# Altium schematic sheet mounting_circuit(4).SchDoc
size A4; SheetNumber: 5; SheetTotal: 5
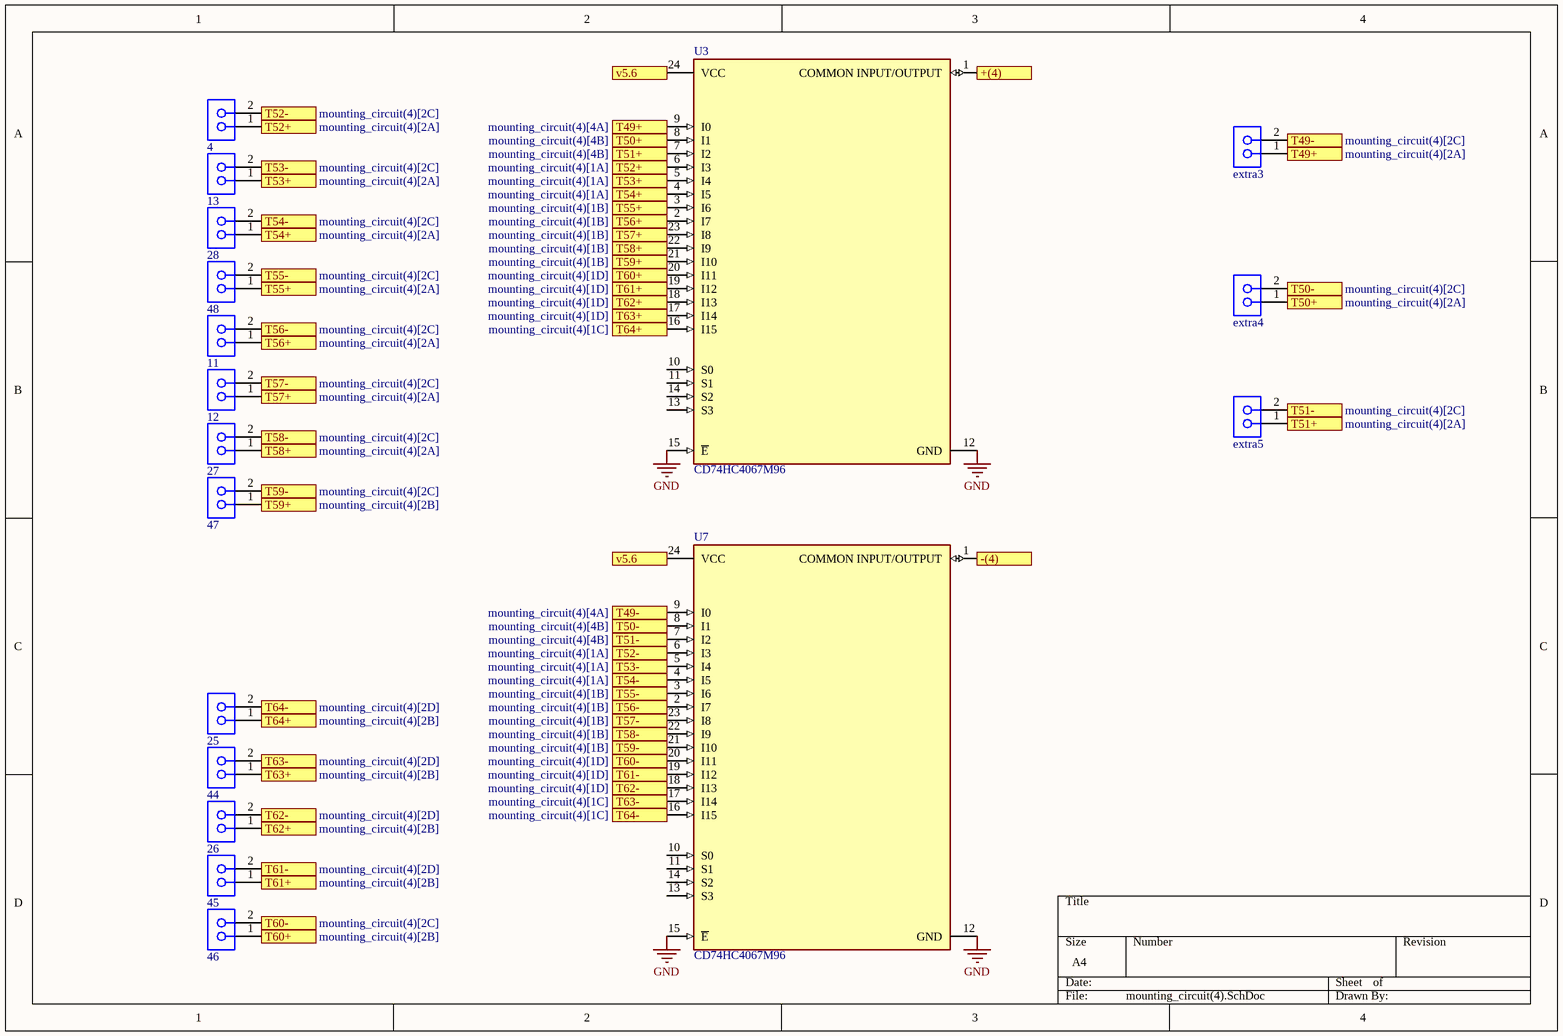
[diagram p0: mounting_circuit(4).SchDoc]

## Parts
4  Comment  [SMTC-SSW-102-02-X-S]  (value not drawn)
11  1  [SMTC-SSW-102-02-X-S]  (value not drawn)
12  Comment  [SMTC-SSW-102-02-X-S]  (value not drawn)
13  Comment  [SMTC-SSW-102-02-X-S]  (value not drawn)
25  0  [SMTC-SSW-102-02-X-S]  (value not drawn)
26  Comment  [SMTC-SSW-102-02-X-S]  (value not drawn)
27  Comment  [SMTC-SSW-102-02-X-S]  (value not drawn)
28  Comment  [SMTC-SSW-102-02-X-S]  (value not drawn)
44  0  [SMTC-SSW-102-02-X-S]  (value not drawn)
45  Comment  [SMTC-SSW-102-02-X-S]  (value not drawn)
46  Comment  [SMTC-SSW-102-02-X-S]  (value not drawn)
47  Comment  [SMTC-SSW-102-02-X-S]  (value not drawn)
48  Comment  [SMTC-SSW-102-02-X-S]  (value not drawn)
extra3  Comment  [SMTC-SSW-102-02-X-S]  (value not drawn)
extra4  Comment  [SMTC-SSW-102-02-X-S]  (value not drawn)
extra5  Comment  [SMTC-SSW-102-02-X-S]  (value not drawn)
U3  CD74HC4067M96  [FP-DW0024A-MFG]
U7  CD74HC4067M96  [FP-DW0024A-MFG]

## Ports
+(4), -(4), T49+ (see mounting_circuit(4)[2A]), T49+ (see mounting_circuit(4)[4A]), T49- (see mounting_circuit(4)[2C]), T49- (see mounting_circuit(4)[4A]), T50+ (see mounting_circuit(4)[2A]), T50+ (see mounting_circuit(4)[4B]), T50- (see mounting_circuit(4)[2C]), T50- (see mounting_circuit(4)[4B]), T51+ (see mounting_circuit(4)[2A]), T51+ (see mounting_circuit(4)[4B]), T51- (see mounting_circuit(4)[2C]), T51- (see mounting_circuit(4)[4B]), T52+ (see mounting_circuit(4)[1A]), T52+ (see mounting_circuit(4)[2A]), T52- (see mounting_circuit(4)[1A]), T52- (see mounting_circuit(4)[2C]), T53+ (see mounting_circuit(4)[1A]), T53+ (see mounting_circuit(4)[2A]), T53- (see mounting_circuit(4)[1A]), T53- (see mounting_circuit(4)[2C]), T54+ (see mounting_circuit(4)[1A]), T54+ (see mounting_circuit(4)[2A]), T54- (see mounting_circuit(4)[1A]), T54- (see mounting_circuit(4)[2C]), T55+ (see mounting_circuit(4)[1B]), T55+ (see mounting_circuit(4)[2A]), T55- (see mounting_circuit(4)[1B]), T55- (see mounting_circuit(4)[2C]), T56+ (see mounting_circuit(4)[1B]), T56+ (see mounting_circuit(4)[2A]), T56- (see mounting_circuit(4)[1B]), T56- (see mounting_circuit(4)[2C]), T57+ (see mounting_circuit(4)[1B]), T57+ (see mounting_circuit(4)[2A]), T57- (see mounting_circuit(4)[1B]), T57- (see mounting_circuit(4)[2C]), T58+ (see mounting_circuit(4)[1B]), T58+ (see mounting_circuit(4)[2A]), T58- (see mounting_circuit(4)[1B]), T58- (see mounting_circuit(4)[2C]), T59+ (see mounting_circuit(4)[1B]), T59+ (see mounting_circuit(4)[2B]), T59- (see mounting_circuit(4)[1B]), T59- (see mounting_circuit(4)[2C]), T60+ (see mounting_circuit(4)[1D]), T60+ (see mounting_circuit(4)[2B]), T60- (see mounting_circuit(4)[1D]), T60- (see mounting_circuit(4)[2C]), T61+ (see mounting_circuit(4)[1D]), T61+ (see mounting_circuit(4)[2B]), T61- (see mounting_circuit(4)[1D]), T61- (see mounting_circuit(4)[2D]), T62+ (see mounting_circuit(4)[1D]), T62+ (see mounting_circuit(4)[2B]), T62- (see mounting_circuit(4)[1D]), T62- (see mounting_circuit(4)[2D]), T63+ (see mounting_circuit(4)[1D]), T63+ (see mounting_circuit(4)[2B]), T63- (see mounting_circuit(4)[1C]), T63- (see mounting_circuit(4)[2D]), T64+ (see mounting_circuit(4)[1C]), T64+ (see mounting_circuit(4)[2B]), T64- (see mounting_circuit(4)[1C]), T64- (see mounting_circuit(4)[2D]), v5.6 (see mounting_circuit(2)[2A], mounting_circuit(2)[2C], mounting_circuit(3)[2A], mounting_circuit(3)[2C], mounting_circuit(4)[2A], mounting_circuit[1A], mounting_circuit[3A], mounting_circuit[3B]), v5.6 (see mounting_circuit(2)[2A], mounting_circuit(2)[2C], mounting_circuit(3)[2A], mounting_circuit(3)[2C], mounting_circuit(4)[2C], mounting_circuit[1A], mounting_circuit[3A], mounting_circuit[3B])

## Nets
GND: U3.12(GND) U3.15(~{E}) U7.12(GND) U7.15(~{E})
+(4): U3.1(COMMON_INPUT/OUTPUT) ; port +(4)
-(4): U7.1(COMMON_INPUT/OUTPUT) ; port -(4)
T49+: extra3.1 U3.9(I0) ; port T49+
T49-: extra3.2 U7.9(I0) ; port T49-
T50+: extra4.1 U3.8(I1) ; port T50+
T50-: extra4.2 U7.8(I1) ; port T50-
T51+: extra5.1 U3.7(I2) ; port T51+
T51-: extra5.2 U7.7(I2) ; port T51-
T52+: 4.1 U3.6(I3) ; port T52+
T52-: 4.2 U7.6(I3) ; port T52-
T53+: 13.1 U3.5(I4) ; port T53+
T53-: 13.2 U7.5(I4) ; port T53-
T54+: 28.1 U3.4(I5) ; port T54+
T54-: 28.2 U7.4(I5) ; port T54-
T55+: 48.1 U3.3(I6) ; port T55+
T55-: 48.2 U7.3(I6) ; port T55-
T56+: 11.1 U3.2(I7) ; port T56+
T56-: 11.2 U7.2(I7) ; port T56-
T57+: 12.1 U3.23(I8) ; port T57+
T57-: 12.2 U7.23(I8) ; port T57-
T58+: 27.1 U3.22(I9) ; port T58+
T58-: 27.2 U7.22(I9) ; port T58-
T59+: 47.1 U3.21(I10) ; port T59+
T59-: 47.2 U7.21(I10) ; port T59-
T60+: 46.1 U3.20(I11) ; port T60+
T60-: 46.2 U7.20(I11) ; port T60-
T61+: 45.1 U3.19(I12) ; port T61+
T61-: 45.2 U7.19(I12) ; port T61-
T62+: 26.1 U3.18(I13) ; port T62+
T62-: 26.2 U7.18(I13) ; port T62-
T63+: 44.1 U3.17(I14) ; port T63+
T63-: 44.2 U7.17(I14) ; port T63-
T64+: 25.1 U3.16(I15) ; port T64+
T64-: 25.2 U7.16(I15) ; port T64-
v5.6: U3.24(VCC) U7.24(VCC) ; port v5.6

Not connected (* = marked no-connect by the designer): U3 10(S0) 11(S1) 13(S3) 14(S2); U7 10(S0) 11(S1) 13(S3) 14(S2)

## Library data of the parts
4 11-13 25-28 44-48 extra3-extra5 = CMP-1023-00323-1: SQ Post Socket, Through-hole, Vertical, -55 to 105 degC, 2.54 mm Pitch, 2-Pin, Female, RoHS; Manufacturer: Samtec; PartNumber: SSW-102-02-T-S; Pitch: 2.54 mm; ComponentLink3Description: Package Specification; ComponentLink2Description: Datasheet; ComponentLink1Description: Manufacturer URL; PackageVersion: CA, 6/1987; DatasheetVersion: F-214; PackageDescription: Assembly, Socket Strip .016 X .031 Tail; ComponentLink2URL: http://www.samtec.com/documents/webfiles/pdf/SSW_TH.PDF; RoHS: True; ComponentLink3URL: http://www.samtec.com/documents/webfiles/cpdf/SSW-1XX-XX-XXX-X-XX-XXX-XX-MKT.pdf; ComponentLink1URL: http://www.samtec.com; PackageReference: SSW-102-02-X-S; Mounting Technology: Through-hole; Orientation: Vertical; Temperature Range: -55 to 105 degC
U3 U7 = CMP-04901-000007-1: IC MUX/DEMUX 1X16 24SOIC; Manufacturer: Texas Instruments; Standoff Height: 0.1mm; Logic Function Desc: Non-Inverting; Max Supply Voltage: 6V; Number Of Inputs: 16; Quiescent Current: 8uA; Number Of Circuits: 1; Propagation Delay: 6ns; Max Junction Temp: +150°C; Min Supply Voltage: 2V; ComponentLink2Description: Datasheet; Octopart: https://octopart.com/cd74hc4067m96-texas+instruments-722802; Ambient Temperature Range High: +125°C; Ipc Land Pattern Name: SOIC127P1030X265-24; Height: 2.65mm; Mouser Description: Multiplexer Switch ICs Hi-Spd CMOS 16Ch Anl Mltplxr/Demltplxr; Temperature Range Low: -55°C; Package: DW0024A; Temperature Range High: +125°C; Lead Free: Yes; ComponentLink2URL: http://www.ti.com/lit/ds/symlink/cd74hc4067.pdf; Manufacturer Part Number: CD74HC4067M96; RoHS: TRUE; Automotive: No; Device Class L1: Integrated Circuits (ICs); Digikey Description: IC MUX/DEMUX 1X16 24SOIC; Device Class L2: Logic ICs; Temperature: -55°C to +125°C; Device Class L3: Multiplexers; Category: IC; Ambient Temperature Range Low: -55°C; Number Of Outputs: 1